# Altium schematic sheet STEP_MOTOR_DRIVER.SchDoc
size 420 x 297 mm; SheetNumber: 11; SheetTotal: 11
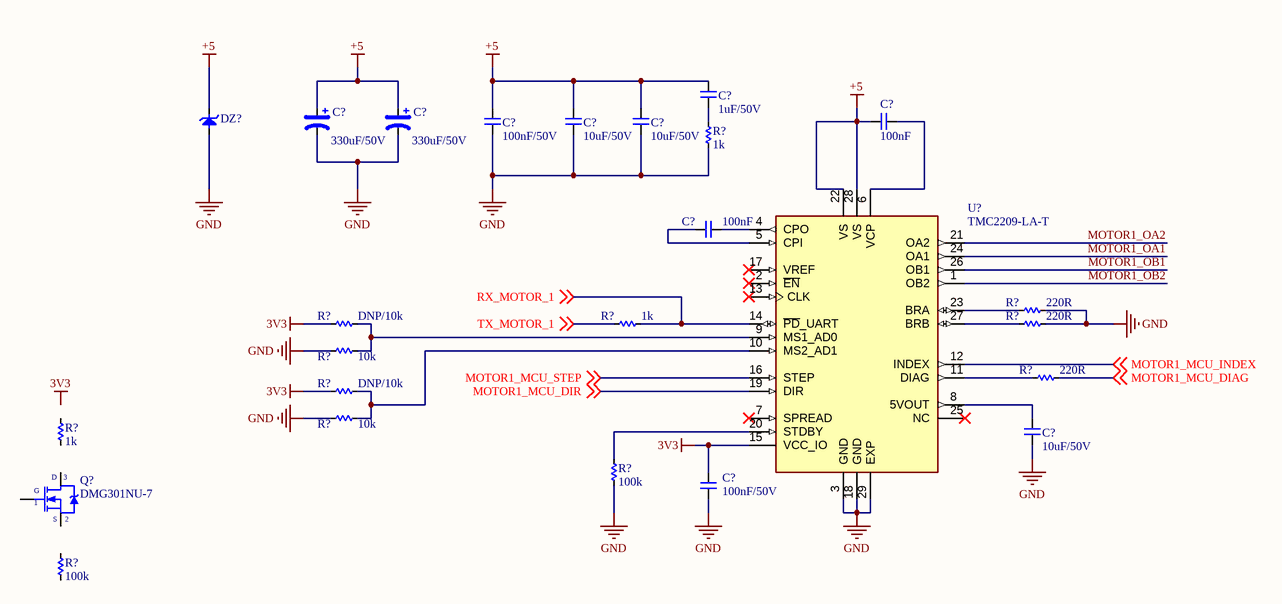
[diagram p0: STEP_MOTOR_DRIVER.SchDoc]

## Parts
(Parts that share a designator on the sheet are numbered #1, #2 ... from top to bottom, then left to right.)
C?#1  1uF/50V  [CAP_C_1005X60]
C?#2  330uF/50V  [CAP_MP_3216X180]
C?#3  330uF/50V  [CAP_MP_3216X180]
C?#4  100nF/50V  [CAP_C_1005X60]
C?#5  10uF/50V  [CAP_C_1005X60]
C?#6  10uF/50V  [CAP_C_1005X60]
C?#7  100nF  [CAP_C_1005X60]
C?#8  100nF  [CAP_C_1005X60]
C?#9  10uF/50V  [CAP_C_1005X60]
C?#10  100nF/50V  [CAP_C_1005X60]
DZ?  DIODE Zener  [DIO-0.5A-SMALL]  (value not drawn)
Q?  DMG301NU-7  [SOT95P240X120-3N]
R?#1  1k  [RES_C_1005X40]
R?#2  220R  [RES_C_1005X40]
R?#3  DNP/10k  [RES_C_1005X40]
R?#4  1k  [RES_C_1005X40]
R?#5  220R  [RES_C_1005X40]
R?#6  10k  [RES_C_1005X40]
R?#7  220R  [RES_C_1005X40]
R?#8  DNP/10k  [RES_C_1005X40]
R?#9  10k  [RES_C_1005X40]
R?#10  1k  [RES_C_1005X40]
R?#11  100k  [RES_C_1005X40]
R?#12  100k  [RES_C_1005X40]
U?  TMC2209-LA-T  [QFN50P500X500X90-29N]

## Nets
3V3: C?#10.2 R?#3.2 R?#8.2 U?.15(VCC_IO)
+5: C?#1.2 C?#2.1 C?#3.1 C?#4.2 C?#5.2 C?#6.2 C?#7.2 DZ?.1(K) U?.22(VS) U?.28(VS)
GND: C?#2.2 C?#3.2 C?#4.1 C?#5.1 C?#6.1 C?#9.1 C?#10.1 DZ?.2(A) R?#1.1 R?#2.2 R?#5.2 R?#6.2 R?#9.2 R?#11.1 U?.3(GND) U?.18(GND) U?.29(EXP)
MOTOR1_MCU_DIAG: R?#7.2 ; off-sheet MOTOR1_MCU_DIAG
MOTOR1_MCU_DIR: U?.19(DIR) ; off-sheet MOTOR1_MCU_DIR
MOTOR1_MCU_INDEX: U?.12(INDEX) ; off-sheet MOTOR1_MCU_INDEX
MOTOR1_MCU_STEP: U?.16(STEP) ; off-sheet MOTOR1_MCU_STEP
MOTOR1_OA1: U?.24(OA1)
MOTOR1_OA2: U?.21(OA2)
MOTOR1_OB1: U?.26(OB1)
MOTOR1_OB2: U?.1(OB2)
RX_MOTOR_1: R?#4.2 U?.14(~{PD}_UART) ; off-sheet RX_MOTOR_1
TX_MOTOR_1: R?#4.1 ; off-sheet TX_MOTOR_1
NetC?#1_1: C?#1.1 R?#1.2
NetC?#7_1: C?#7.1 U?.6(VCP)
NetC?#8_1: C?#8.1 U?.4(CPO)
NetC?#8_2: C?#8.2 U?.5(CPI)
NetC?#9_2: C?#9.2 U?.8(5VOUT)
NetR?#2_1: R?#2.1 U?.23(BRA)
NetR?#3_1: R?#3.1 R?#6.1 U?.9(MS1_AD0)
NetR?#5_1: R?#5.1 U?.27(BRB)
NetR?#7_1: R?#7.1 U?.11(DIAG)
NetR?#8_1: R?#8.1 R?#9.1 U?.10(MS2_AD1)
NetR?#11_2: R?#11.2 U?.20(STDBY)

Not connected (* = marked no-connect by the designer): Q? 1(G) 2(S) 3(D); R?#10 1 2; R?#12 1 2; U? 2(~{EN})* 7(SPREAD)* 13(CLK)* 17(VREF)* 25(NC)*

## Notes on the sheet
- Labels drawn without touching a wire or pin: 3V3
- Project
- Sub-system:
- Design by:
- Sheet title:
- Sheet:
- of
- Checked by:
- Approved by:
- Doc no:
- Revision
- Size:
- Date:

## Library data of the parts
C?#1 C?#4-C?#10 = _CAP_C_2: CAP
C?#2 C?#3 = _CAP_Pola_High_2: CAP Polarization High Value
DZ? = DIODE Zener: Zenner
Q? = MOSFET_N_GSD
R?#1-R?#12 = _RES_B_2: RES
U? = TMC2209-LA-T: Bipolar Motor Driver Power MOSFET Step/Direction, UART 28-QFN (5x5); MF: Trinamic Motion Control GmbH; SnapEDA_Link: https://www.snapeda.com/parts/TMC2209-LA-T/Trinamic/view-part/?ref=snap; Package: VFQFN-28 Trinamic; Value: *; MP: TMC2209-LA-T; Check_prices: https://www.snapeda.com/parts/TMC2209-LA-T/Trinamic/view-part/?ref=eda